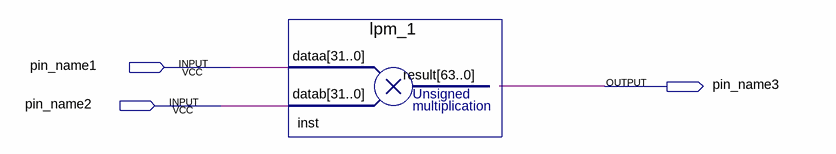
[diagram p0: schematic sheet]
// Quartus schematic fix.bdf as structural Verilog: 1 symbols, 3 pins
module fix (
  input  pin_name1,
  input  pin_name2,
  output pin_name3
);

  lpm_1 inst (.dataa({32{pin_name1}}), .datab({32{pin_name2}}), .result(pin_name3));
endmodule
